# EasyEDA Pro project CH32V203C8T6采样模块.eprj, board RS485PCB
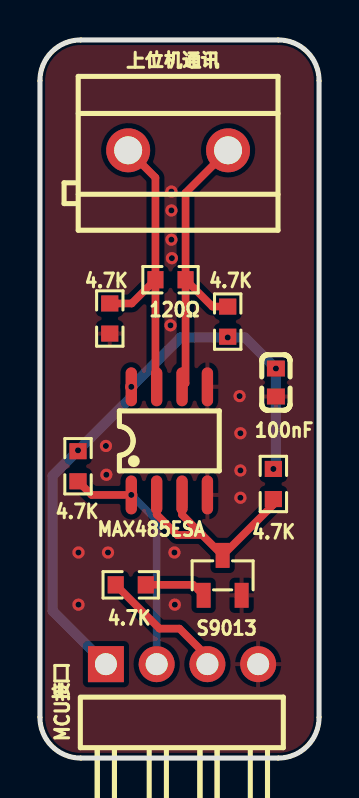
[diagram p5: board, top side]
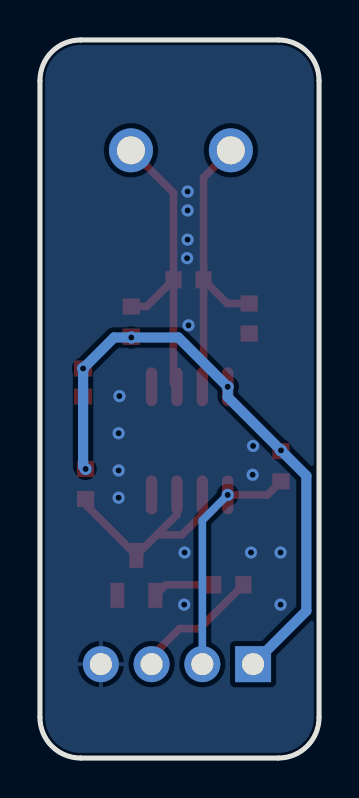
[diagram p6: board, bottom side, seen from below]

Outline 13.97 x 35.94 mm; copper layers: Top Layer, Bottom Layer. Coordinates in mm from the lower left corner of the outline.
Outline path: 0,33.91 0,2.03 arc(0.6,0.6) 2.03,0 11.94,0 arc(13.37,0.6) 13.97,2.03 13.97,33.91 arc(13.37,35.35) 11.94,35.94 2.03,35.94 arc(0.6,35.35) 0,33.91
Stack: Top Layer 0.035mm / Dielectric1 1.51mm FR4 er 4.5 / Bottom Layer 0.035mm

## Design rules (mm)
template: JLCPCB Capability(Two Layers Board)
spacing copperThickness1oz (default): track to track 0.102, other pairs 0.152 to 0.3
spacing copperThickness2oz: track to track 0.203, other pairs 0.152 to 0.3
track width copperThickness1oz (default): min 0.127, default 0.254, max 2.54
track width copperThickness2oz: min 0.203, default 0.254, max 2.54
differential pair differentialPair (default): width min 0.127, default 0.254, max 2.54; gap min 0.152, default 0.152
via viaSize (default): diameter min 0.5, default 0.61, max 10; hole min 0.3, default 0.305, max 6.3

## Placement (name value [footprint] x y rotation side)
4.7K  -  [R0603]  1.91 14.61 90 top
4.7K#2  -  [R0603]  9.4 21.84 90 top
4.7K#3  -  [R0603]  3.5 22 270 top
4.7K#4  -  [R0603]  4.54 8.67 180 top
4.7K#5  -  [R0603]  11.68 13.72 90 top
100nF  100nF  [C0603]  11.81 18.8 270 top
120Ω  120Ω  [R0603]  6.53 23.94 180 top
MAX485ESA  MAX485ESA+T  [SOIC-8_L5.0-W4.0-P1.27-LS6.0-BL]  6.48 15.88 0 top
MCU接口  MCU接口  [HDR-TH_4P-P2.54-H-M-W10.4]  7.11 4.7 0 top
S9013  S9013 J3(RANGE:200-350)  [SOT-23-3_L2.9-W1.3-P1.90-LS2.4-BR]  9.14 9.14 270 top
上位机通讯  上位机通讯  [CONN-TH_P5.00_KF301-5.0-2P]  6.92 30.42 180 top

## Footprints (pads in the part's own frame, mm; a bottom-side part is the same pattern mirrored in y, then rotated)
C0603
  rect 0.8x0.9 smd: 1(-0.7,0) 2(0.7,0)
CONN-TH_P5.00_KF301-5.0-2P
  round 2.2 hole 1.4: 1(-2.5,0) 2(2.5,0)
HDR-TH_4P-P2.54-H-M-W10.4
  rect 1.8x1.8 hole 1.1: 1(-3.81,0)
  round 1.8 hole 1.1: 2(-1.27,0) 3(1.27,0) 4(3.81,0)
R0603
  rect 0.806x0.864 smd: 1(-0.753,0) 2(0.753,0)
SOIC-8_L5.0-W4.0-P1.27-LS6.0-BL
  oval 0.569x1.95 smd: 1(-1.905,-2.705) 2(-0.635,-2.705) 3(0.635,-2.705) 4(1.905,-2.705) 5(1.905,2.705) 6(0.635,2.705) 7(-0.635,2.705) 8(-1.905,2.705)
SOT-23-3_L2.9-W1.3-P1.90-LS2.4-BR
  rect 1.25x0.7 smd: 1(1,-0.95) 2(1,0.95) 3(-1,0)

## Nets
3V3: 4.7K.2 4.7K#2.1 4.7K#5.2 100nF.1 MAX485ESA.8 MCU接口.1
GND: 4.7K#3.2 100nF.2 MAX485ESA.4 MAX485ESA.5 MCU接口.4 S9013.2
RS485A: 4.7K#2.2 120Ω.1 MAX485ESA.6 上位机通讯.1
RS485B: 4.7K#3.1 120Ω.2 MAX485ESA.7 上位机通讯.2
UARTRX: 4.7K.1 MAX485ESA.1 MCU接口.2
UARTTX: 4.7K#4.2 MCU接口.3
$1N606: 4.7K#4.1 S9013.1
$1N610: 4.7K#5.1 MAX485ESA.2 MAX485ESA.3 S9013.3

## Via types
v1: diameter 0.61, hole 0.305, Top Layer to Bottom Layer, 22 vias

## Routing (per net, layer and track width the routed paths; a pad name or vN(x,y) marks a point on that pad's centre or on a via; arc(x,y) is an arc through that point)
3V3: length 30.6
  Bottom Layer w0.508: MCU接口.1 0.63,7.37 0.63,14.13 v1(1.91,15.4) 4.57,18.07 v1(4.57,18.58) 7.04,21.05 v1(9.4,21.05) 10.26,21.05 v1(11.81,19.5) 11.81,14.6 v1(11.68,14.47)
GND:
  vias: v1(1.93,10.29) v1(1.93,7.68) v1(3.3,15.62) v1(3.32,14.18) v1(3.41,10.29) v1(6.53,21.66) v1(6.58,28.35) v1(6.58,27.41) v1(6.58,25.95) v1(6.6,25.02) v1(6.73,10.29) v1(6.75,7.68) v1(9.99,18.12) v1(10.03,16.26) v1(10.03,14.39) v1(10.03,13.03)
RS485A: length 15.5
  Top Layer w0.381: 120Ω.1 7.29,18.76 MAX485ESA.6 ; 120Ω.1 7.29,28.29 上位机通讯.1 ; 120Ω.1 8.63,22.6 4.7K#2.2
RS485B: length 15.2
  Top Layer w0.381: 120Ω.2 5.78,29.05 上位机通讯.2 ; 120Ω.2 4.59,22.75 4.7K#3.1 ; 120Ω.2 5.78,18.64 MAX485ESA.7
UARTRX: length 11.9
  Top Layer w0.381: v1(4.57,13.17) 2.59,13.17 4.7K.1
  Bottom Layer w0.381: v1(4.57,13.17) 5.84,11.9 MCU接口.2
UARTTX: length 6.5
  Top Layer w0.381: 4.7K#4.2 5.98,6.48 6.98,6.48 8.38,5.08 MCU接口.3
$1N606: length 3.1
  Top Layer w0.381: 4.7K#4.1 7.67,8.67 S9013.1
$1N610: length 11.4
  Top Layer w0.381: 8.12,11.17 7.11,12.18 MAX485ESA.3 ; 8.12,11.17 S9013.3 11.68,12.68 4.7K#5.1 ; 8.12,11.17 6.87,11.17 5.84,12.19 MAX485ESA.2

## Copper pours and planes (outline as drawn; the poured copper is in the pictures)
GND on Top Layer: 0,34.04 0.01,34.21 0.05,34.49 0.13,34.76 0.25,35.02 0.41,35.26 0.6,35.47 0.81,35.66 1.05,35.81 1.3,35.93 1.57,36.02 1.85,36.06 2.03,36.07 12.06,36.07 12.24,36.06 12.52,36.02 12.79,35.93 13.05,35.81 13.29,35.66 13.5,35.47 13.69,35.26 13.84,35.02 13.96,34.76 14.04,34.49 14.09,34.21 14.1,34.04 14.1,1.91 14.09,1.73 14.04,1.45 13.96,1.18 13.84,0.92 13.69,0.68 13.5,0.47 13.29,0.28 13.05,0.13 12.79,0.01 12.52,-0.07 12.24,-0.12 12.06,-0.13 2.03,-0.13 1.85,-0.12 1.57,-0.07 1.3,0.01 1.05,0.13 0.81,0.28 0.6,0.47 0.41,0.68 0.25,0.92 0.13,1.18 0.05,1.45 0.01,1.73 0,1.91
GND on Bottom Layer: 0,34.04 0.01,34.21 0.05,34.49 0.13,34.76 0.25,35.02 0.41,35.26 0.6,35.47 0.81,35.66 1.05,35.81 1.3,35.93 1.57,36.02 1.85,36.06 2.03,36.07 12.06,36.07 12.24,36.06 12.52,36.02 12.79,35.93 13.04,35.81 13.28,35.66 13.5,35.47 13.68,35.26 13.84,35.02 13.96,34.76 14.04,34.49 14.08,34.21 14.09,34.04 14.09,1.98 14.08,1.8 14.04,1.52 13.96,1.25 13.84,1 13.68,0.76 13.5,0.54 13.28,0.36 13.04,0.2 12.79,0.08 12.52,0 12.24,-0.04 12.06,-0.05 2.03,-0.05 1.85,-0.04 1.57,0 1.3,0.08 1.05,0.2 0.81,0.36 0.6,0.54 0.41,0.76 0.25,1 0.13,1.25 0.05,1.52 0.01,1.8 0,1.98
